# Altium schematic sheet IsoSPI V0.1.SchDoc
size A4; SheetNumber: 9; SheetTotal: 9
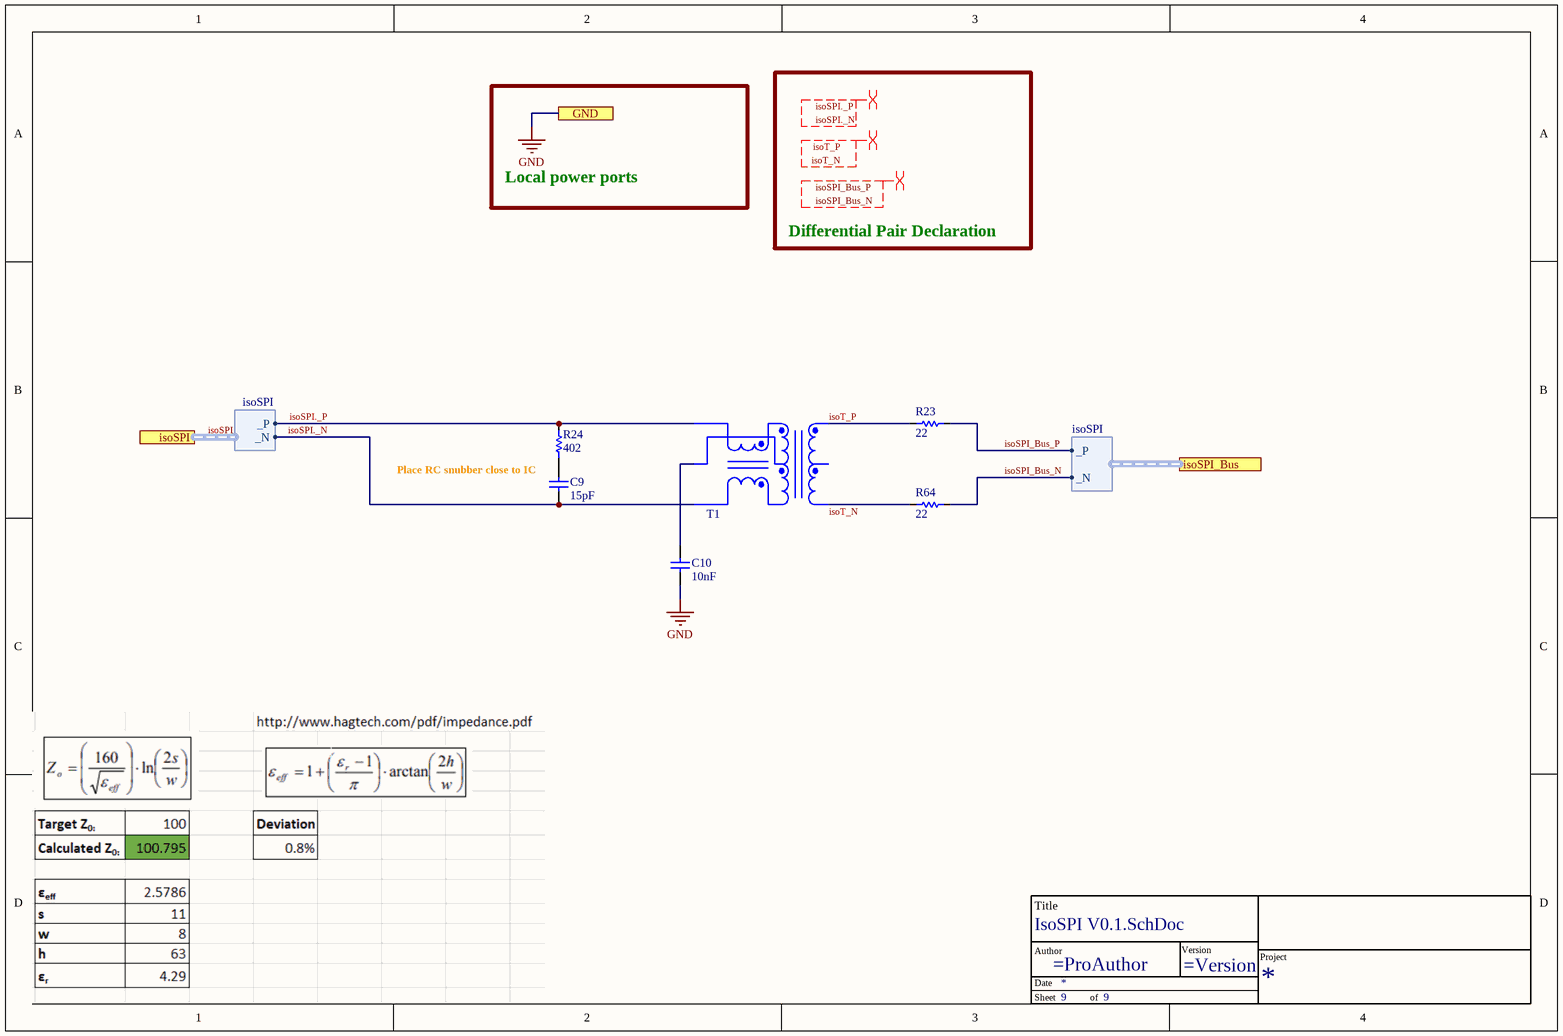
[diagram p0: IsoSPI V0.1.SchDoc]

## Parts
*  TitleBlock  (value not drawn)  (graphical)
C9  value 15pF  [C_0402]  (hidden comment: 885012005026)
C10  value 10nF  [C_0402]  (hidden comment: C1005X7S2A103K050BB)
R23  value 22  [R_0402]  (hidden comment: RC0402JR-1322RL)
R24  value 402  [R_0402]  (hidden comment: CRCW0402402RFKEDC)
R64  value 22  [R_0402]  (hidden comment: RC0402JR-1322RL)
T1  SM91502ALE  [SM91502ALE]  (value not drawn)

## Ports
GND, isoSPI (harness isoSPI), isoSPI_Bus (harness isoSPI)

## Harnesses
isoSPI: _P, _N

## Nets
GND: C10.1 ; port GND
isoSPI._N: C9.1 T1.4 ; port isoSPI._N
isoSPI._P: R24.2 T1.6 ; port isoSPI._P
isoSPI_Bus_N: R64.1 ; port isoSPI_Bus._N
isoSPI_Bus_P: R23.1 ; port isoSPI_Bus._P
isoT_N: R64.2 T1.3
isoT_P: R23.2 T1.1
NetC9_2: C9.2 R24.1
NetC10_2: C10.2 T1.5

Not connected (* = marked no-connect by the designer): T1 2

## Buses and harness runs
harness isoSPI = port isoSPI

## Layout directives
differential pair; differential pair class isoSPI_BUS: isoSPI_Bus_N, isoSPI_Bus_P, isoT_N, isoT_P
differential pair; differential pair class isoSPI: isoSPI._N, isoSPI._P

## Notes on the sheet
- Local power ports
- Differential Pair Declaration
- Place RC snubber close to IC
- Labels drawn without touching a wire or pin: isoSPI._N, isoSPI._P, isoSPI_Bus_N, isoSPI_Bus_P, isoT_N, isoT_P
- (in symbol TitleBlock) Title; Author; Version; Project; Date; Sheet; of

## Library data of the parts
C9 C10 = Capacitor: ComponentLink1Description: New link; ComponentLink1URL: *
  C9: Supplier 1: Mouser; Supplier Part Number 1: 710-885012005026
R23 R24 R64 = Resistor
  R24: Supplier 1: Mouser; Supplier Part Number 1: 71-CRCW0402-402-E3
T1 = SM91502ALE: BMS XFORMER 1-CH 1000V AECQ +125; Manufacturer: Bourns; Inductance: 150uH; Turns Ratio: 1:1; Supplier 1: RSComponents; Manufacturer Part Number: SM91502ALE; RoHS: Yes; Category: Transformers; Stock 1: 1; Pricing 1: 800=2.35100 (USD); Mount: Surface Mount; Min Operating Temperature: -40°C; Max Operating Temperature: 125°C; Packaging: Cut Tape; ComponentLink1URL: https://www.bourns.com/docs/Product-Datasheets/SM91502AL.pdf?src-supplier=Digi-Key; ComponentLink1Description: https://www.bourns.com/docs/Product-Datasheets/SM91502AL.pdf?src-supplier=Digi-Key; Supplier Part Number 1: 1802382